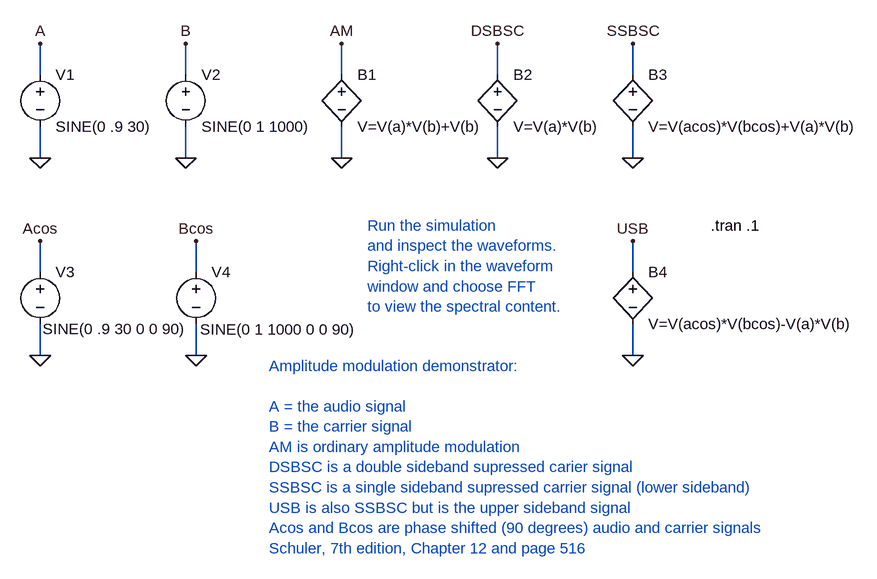
[diagram p0: schematic AM.asc]
AM.asc, the LTspice schematic file:
Version 4
SHEET 1 880 680
WIRE -992 -80 -992 -128
WIRE -768 -80 -768 -128
WIRE -528 -80 -528 -128
WIRE -288 -80 -288 -128
WIRE -80 -80 -80 -128
WIRE -992 48 -992 0
WIRE -768 48 -768 0
WIRE -528 48 -528 0
WIRE -288 48 -288 0
WIRE -80 48 -80 0
WIRE -992 224 -992 176
WIRE -752 224 -752 176
WIRE -80 224 -80 176
WIRE -992 352 -992 304
WIRE -752 352 -752 304
WIRE -80 352 -80 304
FLAG -528 48 0
FLAG -528 -128 AM
FLAG -992 48 0
FLAG -768 48 0
FLAG -992 -128 A
FLAG -768 -128 B
FLAG -288 48 0
FLAG -288 -128 DSBSC
FLAG -80 48 0
FLAG -80 -128 SSBSC
FLAG -992 352 0
FLAG -992 176 Acos
FLAG -752 352 0
FLAG -752 176 Bcos
FLAG -80 352 0
FLAG -80 176 USB
SYMBOL BV -528 -96 R0
SYMATTR InstName B1
SYMATTR Value V=V(a)*V(b)+V(b)
SYMBOL VOLTAGE -992 -96 R0
WINDOW 39 0 0 Left 2
WINDOW 123 0 0 Left 2
SYMATTR InstName V1
SYMATTR Value SINE(0 .9 30)
SYMBOL voltage -768 -96 R0
WINDOW 123 0 0 Left 2
WINDOW 39 0 0 Left 2
SYMATTR InstName V2
SYMATTR Value SINE(0 1 1000)
SYMBOL BV -288 -96 R0
SYMATTR InstName B2
SYMATTR Value V=V(a)*V(b)
SYMBOL BV -80 -96 R0
SYMATTR InstName B3
SYMATTR Value V=V(acos)*V(bcos)+V(a)*V(b)
SYMBOL VOLTAGE -992 208 R0
WINDOW 39 0 0 Left 2
WINDOW 123 0 0 Left 2
WINDOW 3 4 103 Left 2
SYMATTR Value SINE(0 .9 30 0 0 90)
SYMATTR InstName V3
SYMBOL voltage -752 208 R0
WINDOW 123 0 0 Left 2
WINDOW 39 0 0 Left 2
WINDOW 3 6 104 Left 2
SYMATTR Value SINE(0 1 1000 0 0 90)
SYMATTR InstName V4
SYMBOL BV -80 208 R0
SYMATTR InstName B4
SYMATTR Value V=V(acos)*V(bcos)-V(a)*V(b)
TEXT 40 152 Left 2 !.tran .1
TEXT -640 368 Left 2 ;Amplitude modulation demonstrator:\n \nA = the audio signal\nB = the carrier signal\nAM is ordinary amplitude modulation\nDSBSC is a double sideband supressed carier signal\nSSBSC is a single sideband supressed carrier signal (lower sideband)\nUSB is also SSBSC but is the upper sideband signal\nAcos and Bcos are phase shifted (90 degrees) audio and carrier signals\nSchuler, 7th edition, Chapter 12 and page 516
TEXT -488 152 Left 2 ;Run the simulation\nand inspect the waveforms.\nRight-click in the waveform\nwindow and choose FFT\nto view the spectral content.

The netlist it stands for:
* AM.asc
B1 AM 0 V=V(a)*V(b)+V(b)
V1 A 0 SINE(0 .9 30)
V2 B 0 SINE(0 1 1000)
B2 DSBSC 0 V=V(a)*V(b)
B3 SSBSC 0 V=V(acos)*V(bcos)+V(a)*V(b)
V3 Acos 0 SINE(0 .9 30 0 0 90)
V4 Bcos 0 SINE(0 1 1000 0 0 90)
B4 USB 0 V=V(acos)*V(bcos)-V(a)*V(b)
.tran .1
* Amplitude modulation demonstrator:
* A = the audio signal
* B = the carrier signal
* AM is ordinary amplitude modulation
* DSBSC is a double sideband supressed carier signal
* SSBSC is a single sideband supressed carrier signal (lower sideband)
* USB is also SSBSC but is the upper sideband signal
* Acos and Bcos are phase shifted (90 degrees) audio and carrier signals
* Schuler, 7th edition, Chapter 12 and page 516
* Run the simulation
* and inspect the waveforms.
* Right-click in the waveform
* window and choose FFT
* to view the spectral content.
.backanno
.end